# EAGLE design entrenador (EAGLE 7.2.0)
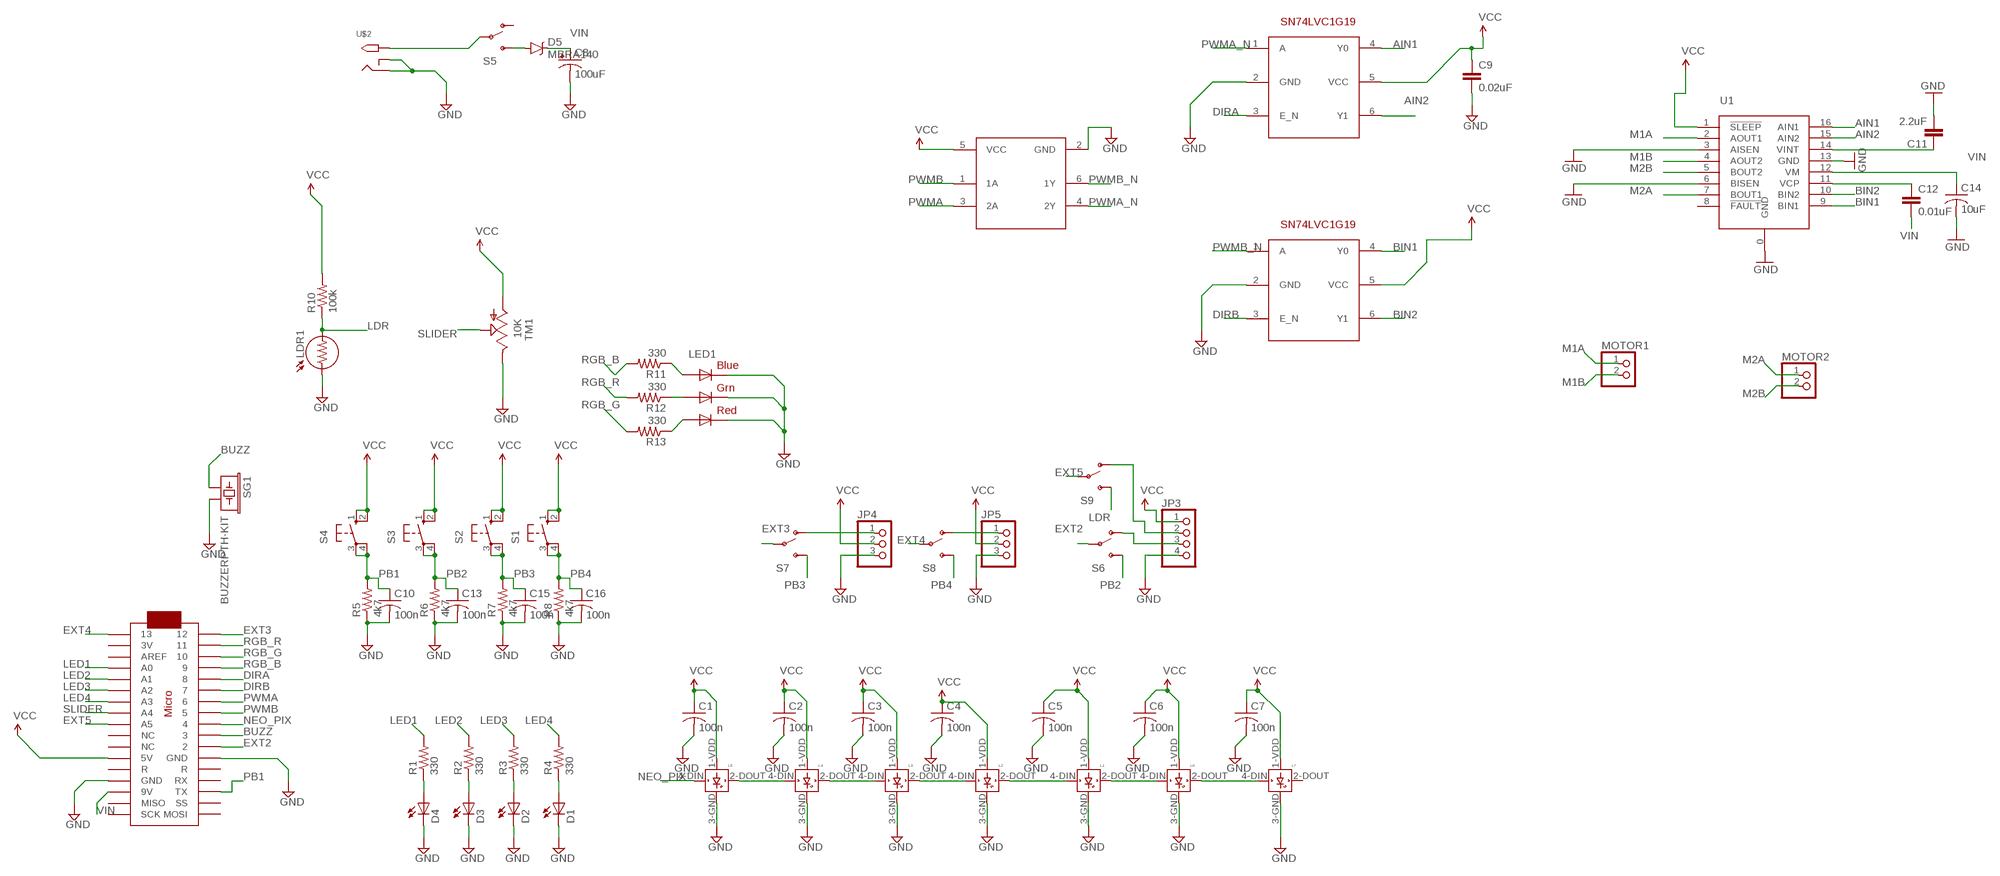
[diagram p0: schematic, sheet 1]

## Parts
C1  100n  C-USC0805  [C0805]
C2  100n  C-USC0805  [C0805]
C3  100n  C-USC0805  [C0805]
C4  100n  C-USC0805  [C0805]
C5  100n  C-USC0805  [C0805]
C6  100n  C-USC0805  [C0805]
C7  100n  C-USC0805  [C0805]
C8  100uF  CPOL-US175TMP-0808  [175TMP-0808]
C9  0.02uF  C-EUC0805  [C0805]
C10  100n  C-USC0805  [C0805]
C11  2.2uF  C-EUC0805  [C0805]
C12  0.01uF  C-EUC0805  [C0805]
C13  100n  C-USC0805  [C0805]
C14  10uF  C-USC0805K  [C0805K]
C15  100n  C-USC0805  [C0805]
C16  100n  C-USC0805  [C0805]
D1  LED5MM  [LED5MM]
D2  LED5MM  [LED5MM]
D3  LED5MM  [LED5MM]
D4  LED5MM  [LED5MM]
D5  MBRA140  [SMA-DIODE]
JP3  PINHD-1X4/90  [1X04/90]
JP4  PINHD-1X3/90  [1X03/90]
JP5  PINHD-1X3/90  [1X03/90]
L1  WS2812B  [WS2812B]
L2  WS2812B  [WS2812B]
L3  WS2812B  [WS2812B]
L4  WS2812B  [WS2812B]
L5  WS2812B  [WS2812B]
L6  WS2812B  [WS2812B]
L7  WS2812B  [WS2812B]
LDR1  LDR5MM  [LDR338-54C]
LED1  RGBLED5050  [RGBLED5050]
MOTOR1  PINHD-1X2/90  [1X02/90]
MOTOR2  PINHD-1X2/90  [1X02/90]
R1  330  R-US_M0805  [M0805]
R2  330  R-US_M0805  [M0805]
R3  330  R-US_M0805  [M0805]
R4  330  R-US_M0805  [M0805]
R5  4k7  R-US_M0805  [M0805]
R6  4k7  R-US_M0805  [M0805]
R7  4k7  R-US_M0805  [M0805]
R8  4k7  R-US_M0805  [M0805]
R10  100k  R-US_M0805  [M0805]
R11  330  R-US_M0805  [M0805]
R12  330  R-US_M0805  [M0805]
R13  330  R-US_M0805  [M0805]
S1  40-XX-ROUND  [B3F-40XX-ROUND]
S2  40-XX-ROUND  [B3F-40XX-ROUND]
S3  40-XX-ROUND  [B3F-40XX-ROUND]
S4  40-XX-ROUND  [B3F-40XX-ROUND]
S5  SWITCH-SPDT-SMD-A  [SWITCH-SPST-SMD-A]
S6  SWITCH-SPDTSS-12F44  [SS-12F44G4]
S7  SWITCH-SPDTSS-12F44  [SS-12F44G4]
S8  SWITCH-SPDTSS-12F44  [SS-12F44G4]
S9  SWITCH-SPDTSS-12F44  [SS-12F44G4]
SG1  BUZZERPTH-KIT  [BUZZER-12MM-KIT]
TM1  10K  TRIMSLIDEPOT-60  [SLIDEPOT-60]
U1  DRV8833  [PWP16]
U$1  SN74LVC1G19SN74LVC1G19-DBVR  [SOT23-6]
U$2  2.1MMJACKTHM  [PJ-102A]
U$8  ARDUINOMICRO  [ARDUINOMICRO]
U$9  SN74LVC1G19SN74LVC1G19-DBVR  [SOT23-6]
U$10  SN74LVC2G04SOT23-6  [SOT23-6]

## Nets
AIN1: U1.16(AIN1) U$1.4(Y0)
AIN2: U1.15(AIN2) U$1.6(Y1)
BIN1: U1.9(BIN1) U$9.4(Y0)
BIN2: U1.10(BIN2) U$9.6(Y1)
BUZZ: SG1.+ U$8.P$10
DIRA: U$1.3(E_N) U$8.P$5
DIRB: U$8.P$6 U$9.3(E_N)
EXT2: S6.2(P) U$8.P$11
EXT3: S7.2(P) U$8.P$1
EXT4: S8.2(P) U$8.P$34
EXT5: S9.2(P) U$8.P$26(A5)
GND: C1.2 C2.2 C3.2 C4.2 C5.2 C6.2 C7.2 C8.- C9.2 C10.2 C11.2 C13.2 C14.2 C15.2 C16.2 D1.K(C) D2.K(C) D3.K(C) D4.K(C) JP3.4 JP4.3 JP5.3 L1.3-GND(GND) L2.3-GND(GND) L3.3-GND(GND) L4.3-GND(GND) L5.3-GND(GND) L6.3-GND(GND) L7.3-GND(GND) LDR1.1 LED1.4(BLUE_C) LED1.5(RED_C) LED1.6(GREEN_C) R5.1 R6.1 R7.1 R8.1 SG1.- TM1.C(E) U1.0(GND) U1.3(AISEN) U1.6(BISEN) U1.13(GND) U$1.2(GND) U$2.RING U$2.RING_SW U$8.P$12(GND) U$8.P$21(GND) U$9.2(GND) U$10.2(GND)
LDR: LDR1.2 R10.1 S9.3(S)
LED1: R1.2 U$8.P$31(A0)
LED2: R2.2 U$8.P$30(A1)
LED3: R3.2 U$8.P$29(A2)
LED4: R4.2 U$8.P$28(A3)
M1A: MOTOR1.1 U1.2(AOUT1)
M1B: MOTOR1.2 U1.4(AOUT2)
M2A: MOTOR2.1 U1.7(BOUT1)
M2B: MOTOR2.2 U1.5(BOUT2)
N$1: D5.A S5.3(S)
N$3: JP3.3 S6.1(O)
N$4: JP3.2 S9.1(O)
N$5: D1.A R4.1
N$6: D2.A R3.1
N$7: D3.A R2.1
N$8: D4.A R1.1
N$9: JP4.1 S7.1(O)
N$10: LED1.3(BLUE_A) R11.1
N$11: LED1.1(GREEN_A) R12.1
N$12: LED1.2(RED_A) R13.1
N$14: C12.1 U1.11(VCP)
N$15: L4.4-DIN(DIN) L5.2-DOUT(DOUT)
N$16: L3.4-DIN(DIN) L4.2-DOUT(DOUT)
N$17: L2.4-DIN(DIN) L3.2-DOUT(DOUT)
N$18: L1.4-DIN(DIN) L2.2-DOUT(DOUT)
N$19: L1.2-DOUT(DOUT) L6.4-DIN(DIN)
N$20: L6.2-DOUT(DOUT) L7.4-DIN(DIN)
N$21: JP5.1 S8.1(O)
N$24: S5.2(P) U$2.TIP
N$63: C11.1 U1.14(VINT)
NEO_PIX: L5.4-DIN(DIN) U$8.P$9
PB1: C10.1 R5.2 S4.3(P) S4.4(P1) U$8.P$15(TX)
PB2: C13.1 R6.2 S3.3(P) S3.4(P1) S6.3(S)
PB3: C15.1 R7.2 S2.3(P) S2.4(P1) S7.3(S)
PB4: C16.1 R8.2 S1.3(P) S1.4(P1) S8.3(S)
PWMA: U$8.P$7 U$10.3(2A)
PWMA_N: U$1.1(A) U$10.4(2Y)
PWMB: U$8.P$8 U$10.1(1A)
PWMB_N: U$9.1(A) U$10.6(1Y)
RGB_B: R11.2 U$8.P$4
RGB_G: R13.2 U$8.P$3
RGB_R: R12.2 U$8.P$2
SLIDER: TM1.B(S) U$8.P$27(A4)
VCC: C1.1 C2.1 C3.1 C4.1 C5.1 C6.1 C7.1 C9.1 JP3.1 JP4.2 JP5.2 L1.1-VDD(VDD) L2.1-VDD(VDD) L3.1-VDD(VDD) L4.1-VDD(VDD) L5.1-VDD(VDD) L6.1-VDD(VDD) L7.1-VDD(VDD) R10.2 S1.1(S) S1.2(S1) S2.1(S) S2.2(S1) S3.1(S) S3.2(S1) S4.1(S) S4.2(S1) TM1.A U1.1(!SLEEP) U$1.5(VCC) U$8.P$23(5V) U$9.5(VCC) U$10.5(VCC)
VIN: C8.+ C12.2 C14.1 D5.C U1.12(VM) U$8.P$20(9V)
Unconnected: L7.2-DOUT(DOUT) S5.1(O) U1.8(!FAULT) U$8.P$13(R) U$8.P$14(RX) U$8.P$16(SS) U$8.P$17(MOSI) U$8.P$18(SCK) U$8.P$19(MISO) U$8.P$22(R) U$8.P$24(NC) U$8.P$25(NC) U$8.P$32(AREF) U$8.P$33(3V)

## Library data of the parts
C1-C7 C10 C13-C16 = adafruit:C-US: CAPACITOR, American symbol
C8 = adafruit:CPOL-US: POLARIZED CAPACITOR, American symbol
C9 C11 C12 = rcl:C-EU: CAPACITOR, European symbol
D1-D4 = adafruit:LED: LED OSRAM: - CHIPLED LG R971, LG N971, LY N971, LG Q971, LY Q971, LO R971, LY R971 LH N974, LH R974 LS Q976, LO Q976, LY Q976 LO Q996 - Hyper CHIPLED LW Q18S LB Q993, LB Q99A, LB R99A - SideLED LS A670, LO A670, LY A670, LG A670, LP A670 LB A673, LV A673, LT A673, LW A673 LH A674 LY A675 LS A676, LA A676, LO A676, LY A676, LW A676 LS A679, LY A679, LG A679 - Hyper Micro SIDELED® LS Y876, LA Y876, LO Y876, LY Y876 LT Y87S - SmartLED LW L88C, LW L88S LB L89C, LB L89S, LG L890 LS L89K, LO L89K, LY L89K LS L896, LA L896, LO L896, LY L896 - TOPLED LS T670, LO T670, LY T670, LG T670, LP T670 LSG T670, LSP T670, LSY T670, LOP T670, LYG T670 LG T671, LOG T671, LSG T671 LB T673, LV T673, LT T673, LW T673 LH T674 LS T676, LA T676, LO T676, LY T676, LB T676, LH T676, LSB T676, LW T676 LB T67C, LV T67C, LT T67C, LS T67K, LO T67K, LY T67K, LW E67C LS E67B, LA E67B, LO E67B, LY E67B, LB E67C, LV E67C, LT E67C LW T67C LS T679, LY T679, LG T679 LS T770, LO T770, LY T770, LG T770, LP T770 LB T773, LV T773, LT T773, LW T773 LH T774 LS E675, LA E675, LY E675, LS T675 LS T776, LA T776, LO T776, LY T776, LB T776 LHGB T686 LT T68C, LB T68C - Hyper Mini TOPLED® LB M676 - Mini TOPLED Santana® LG M470 LS M47K, LO M47K, LY M47K Source: http://www.osram.convergy.de/
D5 = SparkFun-DiscreteSemi:MBRA140: 40V, 1A Schottky rectifier SMA/DO-214AC package DIO-08053; PROD_ID: DIO-08053
JP3 = pinhead:PINHD-1X4: PIN HEADER
JP4 JP5 = pinhead:PINHD-1X3: PIN HEADER
L1-L7 = adafruit:WS2812B
LDR1 = gm-resistors:LDR
LED1 = adafruit:RGBLED: For 5050 RGB LEDs, the order of the LEDs may vary from one manufacturer to another!
MOTOR1 MOTOR2 = pinhead:PINHD-1X2: PIN HEADER
R1-R8 R10-R13 = rcl:R-US_: RESISTOR, American symbol
S1-S4 = adafruit:40-XX: OMRON SWITCH
S5 = SparkFun-Electromechanical:SWITCH-SPDT: SPDT Switch Simple slide switch, Spark Fun Electronics SKU : COM-00102 DPDT SMT slide switch, AYZ0202, SWCH-08179; PROD_ID: SWCH-10651
S6-S9 = SparkFun-Electromechanical:SWITCH-SPDT: SPDT Switch Simple slide switch, Spark Fun Electronics SKU : COM-00102 DPDT SMT slide switch, AYZ0202, SWCH-08179
SG1 = SparkFun-Electromechanical:BUZZER: Buzzer 12mm Spark Fun Electronics SKU : Comp-Buzzer; PROD_ID: COMP-08253
TM1 = adafruit:TRIM
U1 = DRV8833:DRV8833
U$1 U$9 = frizzy:SN74LVC1G19
U$2 = adafruit:2.1MMJACK: 2.1mm x 5.5mm THM DC jack with internal switch. Digikey part #PJ-102A, 4UCON part #05537 2.1mm x 5.5mm SMT DC jack with internal switch. Digikey part #PJ-002A-SMT, 4UCON part #03267 By microbuilder.eu & adafruit.com
U$8 = adafruit:ARDUINOMICRO
U$10 = frizzy:SN74LVC2G04

## Board
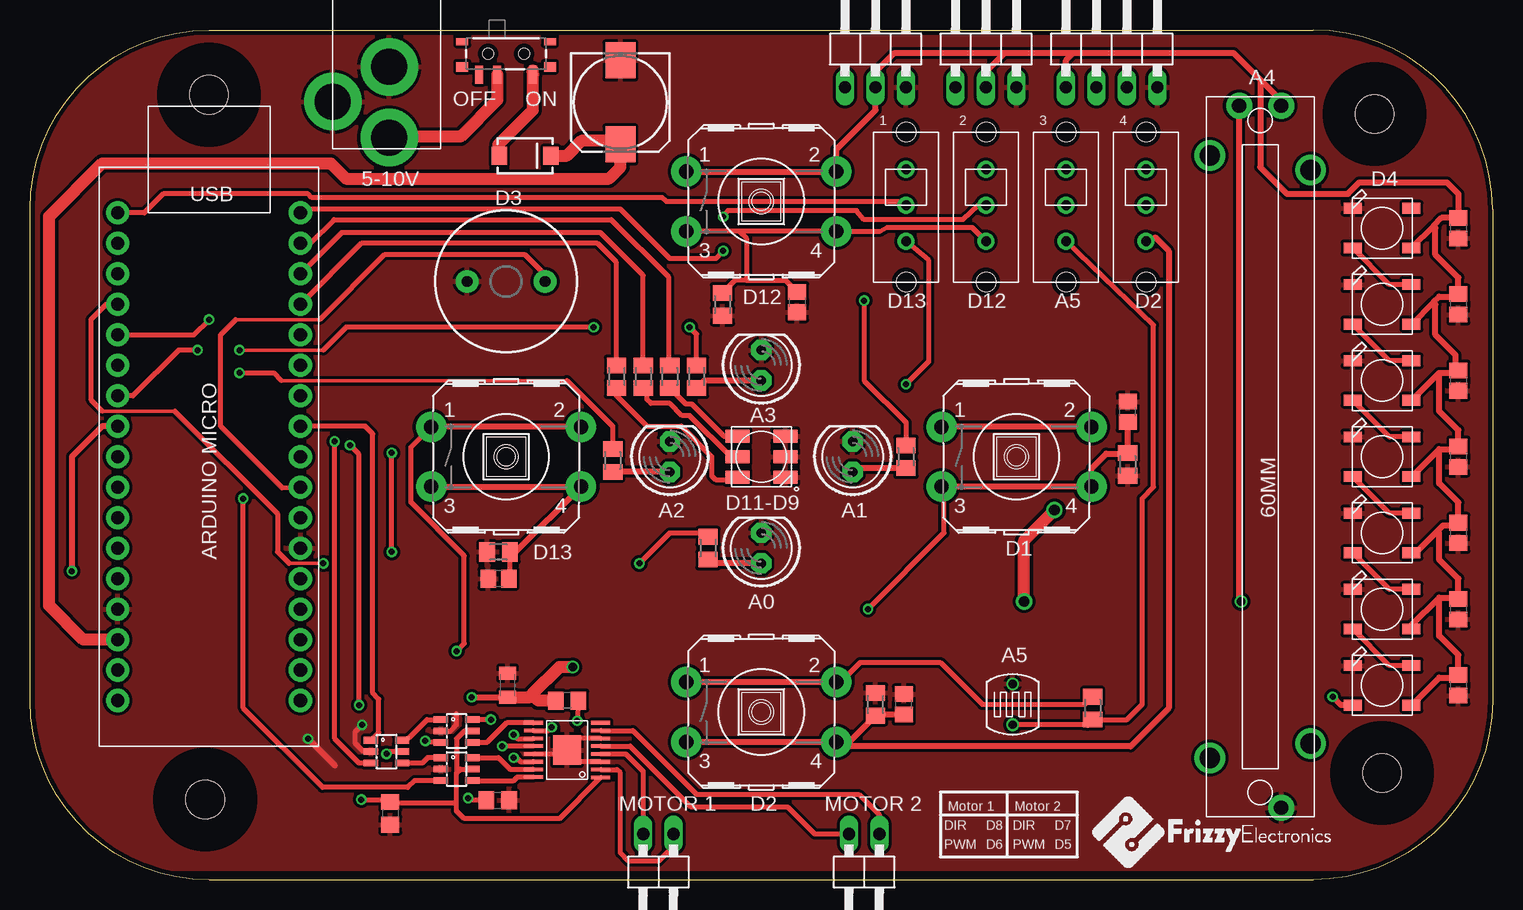
[diagram p1: board, top side]
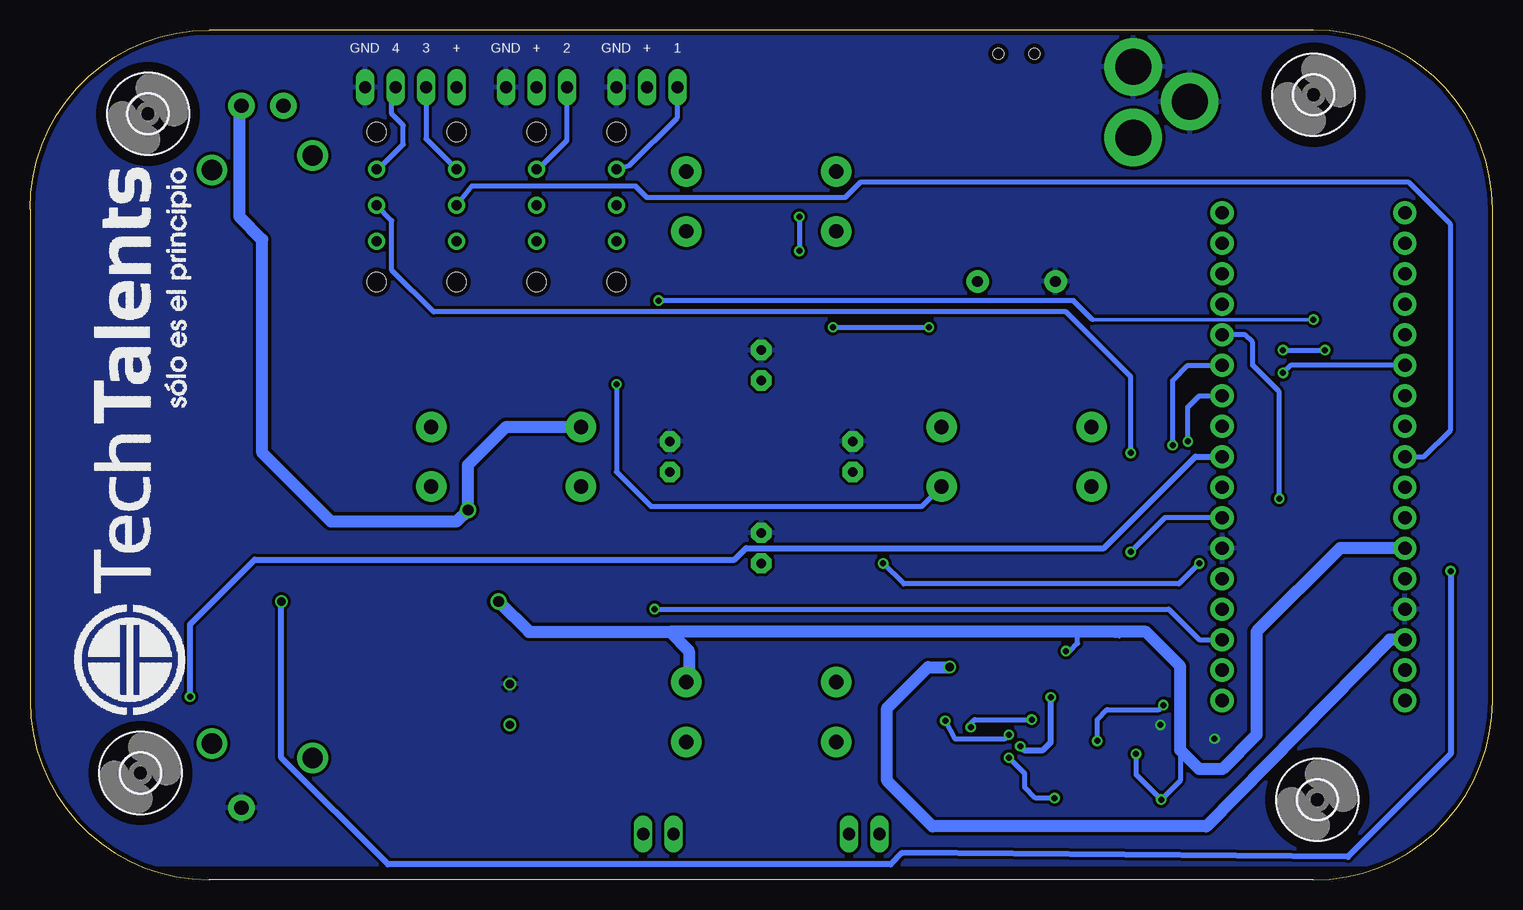
[diagram p2: board, bottom side, seen from below]

Size 121.92 x 70.82 mm. Coordinates in mm from the lower left corner, seen from the top.
Outline: 0,14.94 0,55.9 arc-90 14.92,70.82 107,70.82 arc-90 121.92,55.9 121.92,14.94 arc-90 107,0.02 14.92,0.02
Outline: 14.92,0 arc-90 0,14.92
Copper layers (1*16): Top 0.0356mm / dielectric 1.5011mm / Bottom 0.0356mm
Design rules "oshpark-2layer": minimum track width 6mil, minimum drill 13mil, track to track 6mil, track to pad 6mil, pad to pad 6mil, via to via 6mil, smd to smd 6mil, copper to edge 15mil, drill to drill 6mil, minimum pad ring 7mil, minimum via ring 7mil, stop-mask expansion 2.5mil, vias tented up to drill 0mil, thermal gap 10mil

### Footprints (pad centres in the part's own frame; a part is rotated, then mirrored left to right if it is on the bottom)
C0805 = smd 1.3 x 1.5: 1 -0.85,0; 2 0.85,0
175TMP-0808 = smd 3 x 2.5: + 3.5,0; - -3.5,0
C0805' = smd 1.3 x 1.5: 1 -0.95,0; 2 0.95,0
C0805K = smd 1.1 x 1.4: 1 -1,0; 2 1,0
LED5MM = drill 0.813 pad 1.676 octagon: A -1.27,0; K 1.27,0
SMA-DIODE = smd 1.27 x 1.47: A -2.15,0; C 2.15,0
1X04/90 = drill 1.016 long: 1 -3.81,-3.81; 2 -1.27,-3.81; 3 1.27,-3.81; 4 3.81,-3.81
1X03/90 = drill 1.016 long: 1 -2.54,-3.81; 2 0,-3.81; 3 2.54,-3.81
WS2812B = smd 1.5 x 0.9: 1-VDD 2.45,-1.65; 2-DOUT 2.45,1.65; 3-GND -2.45,1.65; 4-DIN -2.45,-1.65
LDR338-54C = drill 0.7: 1 0,1.702; 2 0,-1.702
RGBLED5050 = smd 2 x 1.1: 1 -2,1.7; 2 -2,0; 3 -2,-1.7; 4 2,-1.7; 5 2,0; 6 2,1.7
1X02/90 = drill 1.016 long: 1 -1.27,-3.81; 2 1.27,-3.81
M0805 = smd 1.3 x 1.6: 1 -0.95,0; 2 0.95,0
B3F-40XX-ROUND = drill 1.194 pad 2.54: 1 -6.248,2.489; 2 6.248,2.489; 3 -6.248,-2.489; 4 6.248,-2.489
SWITCH-SPST-SMD-A = smd 0.7 x 1.5: 1 -2.25,-1.75; 2 -0.75,-1.75; 3 2.25,-1.75 | smd 1 x 0.6: GND1 -3.65,1; GND3 3.65,1 | smd 1 x 0.8: GND2 -3.65,-1.1; GND4 3.65,-1.1 | hole 0.9: -1.5,0; 1.5,0
SS-12F44G4 = drill 0.8 pad 1.422: 1 -3,0; 2 0,0; 3 3,0 | hole 1.6: -6.1,0; 6.4,0
BUZZER-12MM-KIT = drill 0.9 pad 1.88: + 3.25,0; - -3.25,0
SLIDEPOT-60 = drill 1.2 pad 2.184: A -29.249,1.751; B -29.249,-1.749; C 29.251,1.751 | drill 1.7 pad 2.54: P$1 -23.899,4.201; P$2 23.901,4.201; P$3 -25.099,-4.199; P$4 25.101,-4.199
PWP16 = smd 2.46 x 2.31: 0 0,0 | smd 0.3 x 1.6: 1 -2.275,-2.8; 2 -1.625,-2.8; 3 -0.975,-2.8; 4 -0.325,-2.8; 5 0.325,-2.8; 6 0.975,-2.8; 7 1.625,-2.8; 8 2.275,-2.8; 9 2.275,2.8; 10 1.625,2.8; 11 0.975,2.8; 12 0.325,2.8; 13 -0.325,2.8; 14 -0.975,2.8; 15 -1.625,2.8; 16 -2.245,2.8
SOT23-6 = smd 0.55 x 1.2: 1 -0.95,-1.3; 2 0,-1.3; 3 0.95,-1.3; 4 0.95,1.3; 5 0,1.3; 6 -0.95,1.3
PJ-102A = drill 3 pad 4.8: RING 0.1,-3.39; RING_SW -4.6,-6.29; TIP 0.1,-9.29
3,2 = hole 3.2: 0,0
ARDUINOMICRO = drill 1.1 pad 1.93: P$1 -20.32,7.62; P$2 -17.78,7.62; P$3 -15.24,7.62; P$4 -12.7,7.62; P$5 -10.16,7.62; P$6 -7.62,7.62; P$7 -5.08,7.62; P$8 -2.54,7.62; P$9 0,7.62; P$10 2.54,7.62; P$11 5.08,7.62; P$12 12.7,-7.62; P$13 10.16,-7.62; P$14 12.7,7.62; P$15 15.24,7.62; P$16 17.78,7.62; P$17 20.32,7.62; P$18 20.32,-7.62; P$19 17.78,-7.62; P$20 15.24,-7.62; P$21 7.62,7.62; P$22 10.16,7.62; P$23 7.62,-7.62; P$24 5.08,-7.62; P$25 2.54,-7.62; P$26 0,-7.62; P$27 -2.54,-7.62; P$28 -5.08,-7.62; P$29 -7.62,-7.62; P$30 -10.16,-7.62; P$31 -12.7,-7.62; P$32 -15.24,-7.62; P$33 -17.78,-7.62; P$34 -20.32,-7.62

### Placement (x,y rotation side)
C1  119.06,54.31 270 top
C2  119.06,47.96 270 top
C3  119.06,41.61 270 top
C4  119.06,35.26 270 top
C5  119.06,28.91 270 top
C6  119.06,22.56 270 top
C7  119.06,16.21 270 top
C8  49.21,64.79 270 top
C9  0.02uF  [C0805']  30.04,5.54 270 top
C10  91.5,39.01 90 top
C11  2.2uF  [C0805']  38.99,6.62 0 top
C12  0.01uF  [C0805']  44.77,14.94 180 top
C13  72.83,14.62 90 top
C14  39.81,16.21 90 top
C15  63.94,48.15 270 top
C16  39.05,25.1 180 top
D1  60.96,42.88 90 top
D2  53.34,35.26 90 top
D3  68.58,35.26 90 top
D4  60.96,27.64 90 top
D5  41.27,60.34 0 top
JP3  90.17,69.87 0 top
JP4  79.69,69.87 0 top
JP5  70.48,69.87 0 top
L1  112.71,41.61 0 top
L2  112.71,35.26 0 top
L3  112.71,28.91 0 top
L4  112.71,22.56 0 top
L5  112.71,16.21 0 top
L6  112.71,47.96 0 top
L7  112.71,54.31 0 top
LDR1  81.92,14.62 0 top
LED1  60.96,35.26 0 top
MOTOR1  52.39,0.02 180 top
MOTOR2  69.53,0.02 180 top
R1  56.52,27.64 90 top
R2  73.03,35.26 90 top
R3  48.58,34.95 90 top
R4  55.56,41.93 90 top
R5  91.5,34.63 90 top
R6  70.48,14.62 270 top
R7  57.72,47.96 90 top
R8  39.05,27.33 0 top
R10  88.58,14.31 90 top
R11  48.9,41.93 90 top
R12  53.34,41.93 90 top
R13  51.12,41.93 90 top
S1  39.69,35.26 0 top
S2  60.96,56.54 0 top
S3  60.96,13.99 0 top
S4  82.23,35.26 0 top
S5  39.69,68.85 0 top
S6  93.03,56.22 270 top
S7  79.69,56.22 270 top
S8  73.03,56.22 270 top
S9  86.36,56.22 270 top
SG1  39.69,49.87 0 top
TM1  102.55,35.26 270 top
U1  44.77,10.81 90 top
U$1  35.56,9.23 270 top
U$2  29.84,71.14 0 top
U$3  [3,2]  112.08,63.84 0 bottom
U$4  [3,2]  14.92,65.42 0 bottom
U$5  [3,2]  112.71,8.91 0 bottom
U$6  [3,2]  14.61,6.69 0 bottom
U$8  14.92,35.26 270 top
U$9  35.56,12.4 270 top
U$10  29.72,10.69 270 top

### Tracks (layer width: path | path; a pad name or v marks a point on that pad's centre or on a via)
AIN1
  Top 0.406: U$1.4 40.33,8.28 40.64,8.59 41.95,8.59 U1.16
AIN2
  Top 0.406: U$1.6 39.05,10.18 40.01,9.23 41.93,9.23 U1.15
BIN1
  Top 0.406: U$9.4 38.1,11.45 39.74,13.09 U1.9
BIN2  (via drill 0.5)
  Top 0.406: U1.10 43.22,12.44 v43.5,12.72 | v38.42,13.35 U$9.6
  Bottom 0.406: v43.5,12.72 43.5,13.04 43.18,13.35 v38.42,13.35
BUZZ
  Top 0.305: 24.13,46.69 17.14,46.69
  Top 0.406: SG1.+ 42.94,50.43 41.27,52.09 29.53,52.09 24.13,46.69 | 17.14,46.69 15.88,45.42 15.88,37.8 21.02,32.66 U$8.P$10
DIRA  (via drill 0.5)
  Top 0.406: v17.78,31.77 17.78,14.31 24.38,7.7 31.5,7.7 32.07,8.28 U$1.3
  Bottom 0.406: v17.78,31.77 17.78,40.66 20,42.88 20,44.79 20.64,45.42 U$8.P$5
DIRB  (via drill 0.5)
  Top 0.406: U$9.3 33.08,11.45 v32.96,11.58 | v27.43,14.56 27.43,35.45 v26.67,36.22
  Bottom 0.406: v26.67,36.22 26.67,41.61 25.4,42.88 U$8.P$6 | v32.96,11.58 32.96,13.35 32.13,14.18 27.81,14.18 v27.43,14.56
EXT2  (via drill 0.5)
  Top 0.406: v30.16,27.33 v30.16,35.58
  Bottom 0.406: U$8.P$11 27.3,30.18 v30.16,27.33 | v30.16,35.58 30.16,41.93 35.56,47.33 88.27,47.33 91.76,50.82 91.76,54.95 S6.2
EXT3  (via drill 0.5)
  Top 0.406: S7.2 79.06,56.22 77.79,55.01 69.53,55.01 68.9,55.77 58.17,55.77 v57.78,55.27 | v57.78,52.41 57.15,51.77 53.34,51.77 49.21,55.9 22.86,55.9 U$8.P$1
  Bottom 0.406: v57.78,55.27 v57.78,52.41
EXT4
  Top 0.406: U$8.P$34 9.53,55.58 11.11,57.17 23.18,57.17 23.5,56.85 52.7,56.85 53.02,56.54 72.71,56.54 S8.2
EXT5
  Bottom 0.406: U$8.P$26 5.71,35.26 3.49,37.48 3.49,54.63 6.99,58.12 52.7,58.12 53.98,56.85 70.48,56.85 71.44,57.81 85.09,57.81 S9.2
GND  (via drill 0.5)
  Top 0.406: U1.13 44.44,10.49 | U1.6 45.74,11.79 | U1.3 45.74,9.84 | U$10.2 27.81,10.69 27.11,11.39 27.11,12.34 v27.69,12.91 | U$9.2 35.05,12.4 35.56,12.91 35.56,13.86
  Top 0.508: 45.74,11.79 U1.0 | 45.74,9.84 U1.0 | 44.44,10.49 U1.0 | 25.4,9.54 v23.18,11.77
  pour Top (isolate 0.254): 0,70.82 -0.32,0.97 121.6,0.97 121.92,70.82
  pour Bottom (isolate 0.254): -3.17,70.82 -2.86,1.29 125.41,1.29 125.09,70.82
LDR
  Top 0.406: R10.1 91.44,13.36 92.71,14.62 92.71,31.77 93.66,32.72 93.66,46.23 S9.3 | 88.15,12.92 LDR1.2
  Top 0.508: 88.15,12.92 R10.1
LED1  (via drill 0.5)
  Top 0.305: 6.03,39.07 12.06,39.07 | 21.59,26.37 v24.45,26.37
  Top 0.406: U$8.P$31 6.35,47.96 5.08,46.69 5.08,40.02 6.03,39.07 | 12.06,39.07 20.64,30.5 20.64,27.33 21.59,26.37 | R1.2 56.2,28.91 53.34,28.91 v50.8,26.37
  Bottom 0.406: v24.45,26.37 26.16,24.66 49.09,24.66 v50.8,26.37
LED2  (via drill 0.5)
  Top 0.406: U$8.P$30 13.65,45.42 v14.92,46.69 | v69.53,48.28 69.53,41.61 73.03,38.12 R2.2
  Bottom 0.305: v14.92,46.69 33.34,46.69
  Bottom 0.406: 33.34,46.69 34.92,48.28 v69.53,48.28
LED3  (via drill 0.5)
  Top 0.305: 20.95,41.61 44.77,41.61
  Top 0.406: v17.46,42.25 20.32,42.25 20.95,41.61 | 44.77,41.61 48.58,37.8 R3.2
  Bottom 0.406: U$8.P$29 16.83,42.88 v17.46,42.25
LED4  (via drill 0.5)
  Top 0.305: 24.45,44.15 v17.46,44.15
  Top 0.406: v46.99,46.06 26.35,46.06 24.45,44.15 | v13.97,44.15 12.38,44.15 8.57,40.34 U$8.P$28 | R4.2 55.56,45.49 v54.99,46.06
  Bottom 0.406: v54.99,46.06 v46.99,46.06 | v17.46,44.15 v13.97,44.15
M1A
  Top 0.406: U1.2 48.93,9.19 49.21,8.91 49.21,2.24 49.91,1.54 52.39,1.54 53.66,2.81
  Top 0.508: MOTOR1.1 53.66,2.81
M1B
  Top 0.406: U1.4 49.66,10.49 51.12,9.04 MOTOR1.2
M2A
  Top 0.406: U1.7 50.26,12.44 55.56,7.13 69.09,7.13 70.8,5.42 MOTOR2.1
M2B
  Top 0.406: MOTOR2.2 65.41,3.83 63.17,6.06 63.17,6.05 55.12,6.05 50.03,11.14 U1.5
N$1
  Top 1.016: S5.3 41.91,67.46 41.91,64.16 39.05,61.3 39.05,60.42 D5.A
N$3
  Bottom 0.406: JP3.3 91.76,65.74 91.76,63.84 90.81,62.89 90.81,61.3 92.89,59.22 S6.1
N$4
  Bottom 0.406: JP3.2 88.9,61.76 S9.1
N$5
  Top 0.508: D1.A 56.2,41.61 R4.1
N$6
  Top 0.508: D2.A 48.9,33.99 R3.1
N$7
  Top 0.508: R2.1 68.9,34.31 D3.A
N$8
  Top 0.508: D4.A 56.84,26.37 R1.1
N$9
  Bottom 0.406: S7.1 79.23,59.53 77.15,61.61 JP4.1
N$10
  Top 0.406: R11.1 48.9,40.34 51.44,37.8 54.29,37.8 56.83,35.26 56.83,33.68 57.15,33.36 58.76,33.36
  Top 0.508: 58.76,33.36 LED1.3
N$11
  Top 0.406: R12.1 54.68,39.64 55.18,39.64 57.86,36.96 LED1.1
N$12
  Top 0.406: 51.44,40.66 51.44,40.02 51.75,39.71 53.34,39.71 54.36,38.69 54.99,38.69 58.42,35.26
  Top 0.508: LED1.2 58.42,35.26 | 51.44,40.66 R13.1
N$14  (via drill 0.5)
  Top 0.406: C12.1 v45.62,13.25 | v40.32,12.08 40.64,11.77 41.95,11.77 U1.11
  Bottom 0.406: v45.62,13.25 44.83,11.77 40.64,11.77 v40.32,12.08
N$15
  Top 0.406: L5.2-DOUT 113.31,17.86 L4.4-DIN
N$16
  Top 0.406: L4.2-DOUT 113.31,24.21 L3.4-DIN
N$17
  Top 0.406: L3.2-DOUT 113.31,30.56 L2.4-DIN
N$18
  Top 0.406: L2.2-DOUT 113.31,36.91 L1.4-DIN
N$19
  Top 0.406: L1.2-DOUT 113.31,43.26 L6.4-DIN
N$20
  Top 0.406: L6.2-DOUT 113.31,49.61 L7.4-DIN
N$21
  Bottom 0.406: S8.1 71.93,59.53 67.94,63.52 JP5.1
N$24
  Top 1.016: S5.2 38.94,64.99 35.88,61.93 30.03,61.93 U$2.TIP
N$63  (via drill 0.5)
  Top 0.406: C11.1 36.7,6.62 v36.51,6.81 | v40.32,10.18 40.58,10.18 40.89,9.86 41.95,9.86 U1.14
  Bottom 0.406: v36.51,6.81 38.1,6.81 38.99,7.7 38.99,8.85 v40.32,10.18
NEO_PIX  (via drill 0.5)
  Top 0.508: L5.4-DIN 109.28,14.56 v108.58,15.26
  Bottom 0.508: v108.58,15.26 108.58,21.29 103.19,26.69 63.18,26.69 62.23,27.64 32.38,27.64 24.77,35.26 U$8.P$9
PB1  (via drill 0.5)
  Top 0.406: v69.85,22.56 76.2,28.91 76.2,32.56 S4.3
  Top 0.508: S4.3 S4.4 88.48,34.27 89.72,35.52 91.44,35.52 R5.2 C10.1
  Bottom 0.406: v69.85,22.56 26.99,22.56 24.45,20.02 U$8.P$15
PB2
  Top 0.508: S3.4 68.31,11.5 R6.2 70.58,13.78 C13.1 | S3.3 S3.4 | S6.3 93.81,53.54 94.93,52.41 94.93,14.31 91.76,11.13 67.58,11.13 S3.4
PB3
  Top 0.406: 59.12,54.05 S2.4 70.85,54.05 71.44,54.38 78.53,54.38 S7.3 | 59.12,54.05 S2.3 | 59.75,49.95 59.75,53.41 59.12,54.05 | 59.75,49.95 58.76,49.95 R7.2 | 59.75,49.95 62.99,49.95 C15.1
PB4  (via drill 0.5)
  Top 0.406: v73.03,41.3 74.93,43.2 74.93,51.63 S8.3 | C16.1 40,25.1 R8.2
  Top 0.508: R8.2 40.49,27.33 S1.4 S1.3
  Bottom 0.406: v73.03,41.3 73.03,33.99 70.17,31.14 47.57,31.14 S1.4
PWMA  (via drill 0.5)
  Top 0.406: v25.4,36.53 25.4,11.77 27.43,9.74 U$10.3
  Bottom 0.406: v25.4,36.53 25.4,39.39 24.45,40.34 U$8.P$7
PWMA_N
  Top 0.406: U$1.1 33.15,10.18 32.7,9.74 31.59,9.74 U$10.4
PWMB
  Top 0.406: U$8.P$8 27.94,37.8 28.57,37.17 28.57,15.58 29.08,15.07 29.08,12.28 28.45,11.64 U$10.1
PWMB_N
  Top 0.406: U$10.6 31.59,11.86 33.08,13.35 U$9.1
RGB_B
  Top 0.406: R11.2 48.9,51.45 47.31,53.04 27.62,53.04 U$8.P$4
RGB_G
  Top 0.406: R13.2 51.12,50.38 47.56,53.93 25.97,53.93 U$8.P$3
RGB_R
  Top 0.406: U$8.P$2 23.37,53.04 25.34,55.01 48.45,55.01 53.21,50.25 53.21,43.01 R12.2
SLIDER  (via drill 0.5, 0.7)
  Top 0.508: U$8.P$27 6.03,37.8 3.49,35.26 v3.49,25.74 | v100.97,23.2 100.8,23.36 TM1.B
  Bottom 0.508: v3.49,25.74 3.49,10.5 12.06,1.93 49.21,2.24 50.16,1.29 92.08,1.29 100.97,10.17 v100.97,23.2
VCC  (via drill 0.5, 0.9)
  Top 0.406: v35.56,19.07 36.2,19.7 36.2,27.01 31.75,31.45 31.75,36.06 S1.1 | S3.2 67.58,16.48 69.22,18.12 75.88,18.12 79.38,14.62 87.95,14.62 R10.2 | 35.56,6.37 35.56,5.73 36.2,5.1 44.13,5.1 U1.1 | 35.56,6.37 35.56,8.91 | 35.56,8.91 35.88,9.23 U$1.5 | U$9.5 36.2,12.4 35.56,11.77 35.56,8.91 | v27.62,6.69 29.74,6.69 C9.1 30.06,6.37 35.56,6.37 | U$10.5 29.91,10.69 v29.72,10.5
  Top 0.508: S3.2 S3.1 | S4.2 S4.1 | S1.2 S1.1 | S2.1 S2.2 67.21,60.88 70.48,64.16 JP5.2 70.48,67.33 72.07,68.92 81.28,68.92 | 116.98,54.48 117.66,55.16 C1.1 119.06,57.17 118.11,58.12 110.81,58.12 109.86,57.17 104.78,57.17 102.55,59.39 102.55,66.7 | 116.98,54.48 L7.1-VDD | 116.98,54.48 117.16,54.31 117.16,52.09 119.06,50.19 C2.1 118.85,48.6 117.47,48.6 117,48.12 | L6.1-VDD 115.19,46.31 117,48.12 | 117,48.12 117.16,47.96 117.16,45.42 118.85,43.73 118.85,42.46 C3.1 118.85,42.25 117.47,42.25 | L1.1-VDD 115.19,39.96 117.47,42.25 | 117.47,42.25 117.47,39.07 119.06,37.48 C4.1 118.85,35.9 117.47,35.9 117.32,35.74 | L2.1-VDD 115.19,33.61 117.32,35.74 | 117.32,35.74 117.47,35.58 117.47,33.04 119.06,31.45 C5.1 118.85,29.55 117.79,29.55 117.32,29.07 | L3.1-VDD 115.51,27.26 117.32,29.07 | 117.32,29.07 117.47,28.91 117.47,26.69 119.06,25.1 C6.1 118.96,23.52 117.47,23.52 | L4.1-VDD 115.16,21.2 117.47,23.52 | 117.47,23.52 117.47,20.34 119.06,18.75 C7.1 118.85,16.85 117.47,16.85 115.19,14.56 L5.1-VDD | 81.28,68.92 87,68.92 | 87,68.92 100.33,68.92 102.55,66.7 | TM1.A 104.3,64.94 102.55,66.7 | JP4.2 79.69,67.33 81.28,68.92 | JP3.1 86.36,68.28 87,68.92
  Top 1.016: v82.87,23.2 82.87,28.28 v85.41,30.82
  Bottom 0.406: 31.11,20.34 31.43,20.66 | v35.56,19.07 35.24,19.07 34.61,19.7 34.61,20.66 | 26.04,10.81 26.04,8.28 v27.62,6.69 29.72,8.78 v29.72,10.5
  Bottom 1.016: U$8.P$23 12.7,27.64 19.68,20.66 19.68,12.08 22.54,9.23 24.45,9.23 26.04,10.81 26.04,17.8 28.89,20.66 31.43,20.66 34.61,20.66 68.58,20.66 | S3.2 66.99,16.7 66.99,19.07 68.58,20.66 | v82.87,23.2 80.33,20.66 68.58,20.66 | S4.1 82.23,37.75 85.41,34.58 v85.41,30.82 86.36,29.87 96.84,29.87 102.55,35.58 102.55,53.36 104.46,55.27 104.46,64.36 TM1.A
VIN  (via drill 0.5, 0.7)
  Top 0.406: U1.12 v39.38,11.14
  Top 0.508: v39.38,11.14 v39.37,11.13 | v36.83,15.21 C14.1
  Top 1.016: U$8.P$20 4.45,20.02 1.59,22.88 1.59,55.27 6.03,59.71 25.08,59.71 26.35,58.44 48.26,58.44 49.21,59.39 C8.+ | 49.2,61.93 C8.+ | C8.+ 48.89,61.61 46.04,61.61 44.77,60.34 D5.C | v45.26,17.74 44.13,17.74 41.85,15.45 | 41.85,15.45 41.59,15.2 39.83,15.2 C14.1 | C12.2 42.35,14.94 41.85,15.45
  Bottom 0.508: v39.37,11.13 39.05,10.81 37.47,10.81 36.83,11.45 v36.83,15.21
  Bottom 1.016: U$8.P$20 8.57,20.02 23.88,4.46 46.67,4.46 50.48,8.28 50.48,14.31 47.05,17.74 v45.26,17.74

### Text on the board
tNames: A4 | OFF | ON | 1 | 2 | 3 | 4 | 5-10V | D4 | USB | D3 | D12 | D13 | D12 | A5 | D2 | A3 | A2 | D11-D9 | A1 | ARDUINO MICRO | D13 | D1 | A0 | A5 | MOTOR 1 | D2 | MOTOR 2 | Motor 1 | Motor 2 | DIR | D8 | DIR | D7 | PWM | D6 | PWM | D5
bNames: 1 | + | GND | 2 | + | GND | + | 3 | 4 | GND
tStop: v1.1
Document: Entrenador Basico para Arduino Micro.